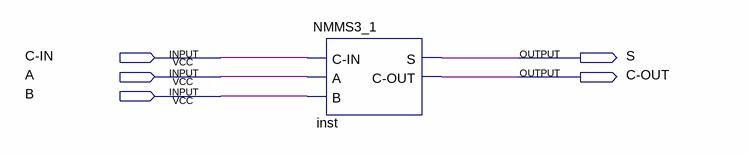
[diagram p0: schematic sheet]
// Quartus schematic NMMS3_1DG.bdf as structural Verilog: 1 symbols, 5 pins
module NMMS3_1DG (
  input  \C-IN ,
  input  A,
  input  B,
  output S,
  output \C-OUT 
);

  NMMS3_1 inst (.\C-IN (\C-IN ), .A(A), .B(B), .S(S), .\C-OUT (\C-OUT ));
endmodule
